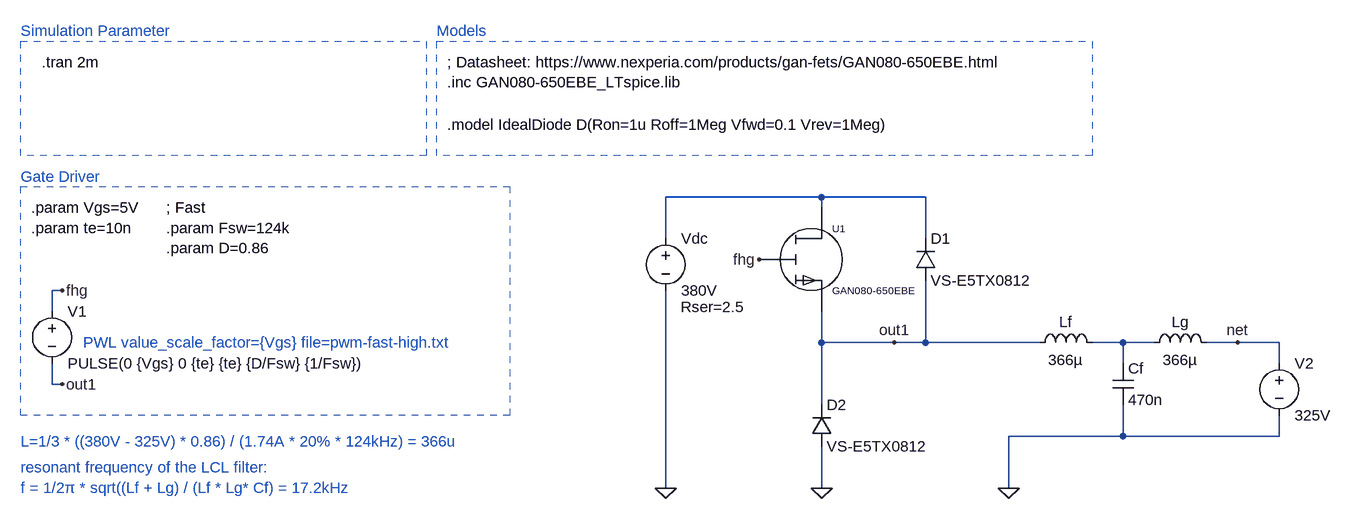
[diagram p0: schematic dc-ac-inverter-static.asc]
dc-ac-inverter-static.asc, the LTspice schematic file:
Version 4
SHEET 1 4648 30344
WIRE -48 -432 -288 -432
WIRE 112 -432 -48 -432
WIRE -48 -416 -48 -432
WIRE -288 -368 -288 -432
WIRE 112 -368 112 -432
WIRE -1216 -288 -1232 -288
WIRE -1232 -256 -1232 -288
WIRE -48 -208 -48 -256
WIRE 64 -208 -48 -208
WIRE 112 -208 112 -304
WIRE 112 -208 64 -208
WIRE 288 -208 112 -208
WIRE 416 -208 368 -208
WIRE 464 -208 416 -208
WIRE 592 -208 544 -208
WIRE 656 -208 592 -208
WIRE 416 -176 416 -208
WIRE 656 -176 656 -208
WIRE -1232 -144 -1232 -176
WIRE -1216 -144 -1232 -144
WIRE -48 -112 -48 -208
WIRE 416 -64 416 -112
WIRE 416 -64 240 -64
WIRE 656 -64 656 -96
WIRE 656 -64 416 -64
WIRE -288 16 -288 -288
WIRE -48 16 -48 -48
WIRE 240 16 240 -64
FLAG -144 -336 fhg
FLAG -48 16 0
FLAG -288 16 0
FLAG -1216 -288 fhg
FLAG -1216 -144 out1
FLAG 64 -208 out1
FLAG 592 -208 net
FLAG 240 16 0
SYMBOL voltage -1232 -272 R0
WINDOW 123 0 0 Left 0
WINDOW 39 0 0 Left 0
SYMATTR InstName V1
SYMATTR Value PULSE(0 {Vgs} 0 {te} {te} {D/Fsw} {1/Fsw})
SYMBOL GAN080-650EBE -64 -336 R0
SYMATTR InstName U1
SYMBOL voltage -288 -384 R0
WINDOW 123 0 0 Left 0
WINDOW 39 23 121 Left 2
SYMATTR SpiceLine Rser=2.5
SYMATTR InstName Vdc
SYMATTR Value 380V
SYMBOL diode -64 -48 M180
WINDOW 0 24 64 Left 2
WINDOW 3 24 0 Left 2
SYMATTR InstName D2
SYMATTR Value VS-E5TX0812
SYMBOL ind 272 -192 R270
WINDOW 0 32 56 VTop 2
WINDOW 3 5 56 VBottom 2
SYMATTR InstName Lf
SYMATTR Value 366µ
SYMBOL cap 400 -176 R0
SYMATTR InstName Cf
SYMATTR Value 470n
SYMBOL ind 448 -192 R270
WINDOW 0 32 56 VTop 2
WINDOW 3 5 56 VBottom 2
SYMATTR InstName Lg
SYMATTR Value 366µ
SYMBOL voltage 656 -192 R0
WINDOW 123 0 0 Left 0
WINDOW 39 0 0 Left 0
SYMATTR InstName V2
SYMATTR Value 325V
SYMBOL diode 96 -304 M180
WINDOW 0 24 64 Left 2
WINDOW 3 24 0 Left 2
SYMATTR InstName D1
SYMATTR Value VS-E5TX0812
TEXT -624 -544 Left 2 !.model IdealDiode D(Ron=1u Roff=1Meg Vfwd=0.1 Vrev=1Meg)
TEXT -1280 -464 Left 2 ;Gate Driver
TEXT -1264 -416 Left 2 !.param Vgs=5V\n.param te=10n
TEXT -640 -688 Left 2 ;Models
TEXT -1248 -640 Left 2 !.tran 2m
TEXT -1280 -688 Left 2 ;Simulation Parameter
TEXT -624 -640 Left 2 !; Datasheet: https://www.nexperia.com/products/gan-fets/GAN080-650EBE.html\n.inc GAN080-650EBE_LTspice.lib
TEXT -1056 -416 Left 2 !; Fast\n.param Fsw=124k\n.param D=0.86
TEXT -1184 -208 Left 2 ;PWL value_scale_factor={Vgs} file=pwm-fast-high.txt
TEXT -1280 -56 Left 2 ;L=1/3 * ((380V - 325V) * 0.86) / (1.74A * 20% * 124kHz) = 366u
TEXT -1280 -16 Left 2 ;resonant frequency of the LCL filter:\nf = 1/2π * sqrt((Lf + Lg) / (Lf * Lg* Cf) = 17.2kHz
RECTANGLE Normal -528 -96 -1280 -448 2
RECTANGLE Normal -656 -496 -1280 -672 2
RECTANGLE Normal 368 -496 -640 -672 2

The netlist it stands for:
* dc-ac-inverter-static.asc
V1 fhg out1 PULSE(0 {Vgs} 0 {te} {te} {D/Fsw} {1/Fsw})
XU1 fhg N001 out1 GAN080-650EBE  ; pins Gate Drain Source
Vdc N001 0 380V Rser=2.5
D2 0 out1 VS-E5TX0812
Lf out1 N002 366µ
Cf N002 0 470n
Lg N002 net 366µ
V2 net 0 325V
D1 out1 N001 VS-E5TX0812
.model D D
.lib standard.dio
.model IdealDiode D(Ron=1u Roff=1Meg Vfwd=0.1 Vrev=1Meg)
* Gate Driver
.param Vgs=5V
.param te=10n
* Models
.tran 2m
* Simulation Parameter
; Datasheet: https://www.nexperia.com/products/gan-fets/GAN080-650EBE.html
.inc GAN080-650EBE_LTspice.lib
; Fast
.param Fsw=124k
.param D=0.86
* PWL value_scale_factor={Vgs} file=pwm-fast-high.txt
* L=1/3 * ((380V - 325V) * 0.86) / (1.74A * 20% * 124kHz) = 366u
* resonant frequency of the LCL filter:
* f = 1/2π * sqrt((Lf + Lg) / (Lf * Lg* Cf) = 17.2kHz
.lib GAN080-650EBE_LTspice.lib
.backanno
.end